# Altium project Capacitive Soil Moisture Sensor.PrjPcb
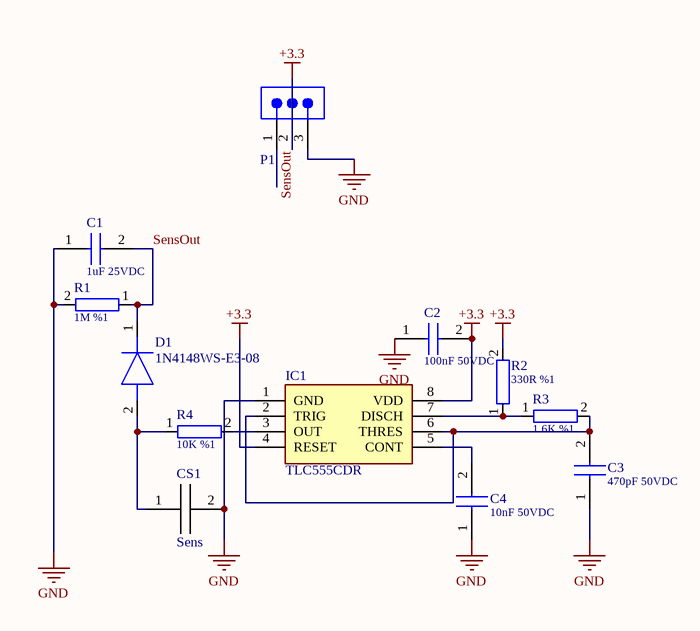
[diagram p0: CSMS.SchDoc]
3 sheets, 23 parts. Net scope: global (net labels, ports and power ports of the same name join across sheets).
Board file: CSMSCMP.PcbDoc
Sheets:
  CSMS.SchDoc
  CSMSF.SchDoc
  CMP.SchDoc

## Sheet CSMS.SchDoc
size A4; SheetNumber: 1; SheetTotal: 3

### Parts
C1  value 1uF 25VDC  [0603 CAP]  (hidden comment: CL10B105KA8NNNC)
C2  value 100nF 50VDC  [0603 CAP]  (hidden comment: CL10B104KB8NNNC)
C3  value 470pF 50VDC  [0603 CAP]  (hidden comment: CL10B471KB8NNNC)
C4  value 10nF 50VDC  [0603 CAP]  (hidden comment: CC0603KRX7R9BB103)
CS1  Sens  [Sens]
D1  1N4148WS-E3-08  [SOD2513X110N]
IC1  TLC555CDR  [SOIC127P600X175-8N]
P1  61300311021  [61300311021]  (value not drawn)
R1  value 1M %1  [0603 RES]  (hidden comment: 0603SAF1004T5E)
R2  value 330R %1  [0603 RES]  (hidden comment: 0603SAF3300T5E)
R3  value 1.6K %1  [0603 RES]  (hidden comment: 0603SAF1601T5E)
R4  value 10K %1  [0603 RES]  (hidden comment: 0603SAF1002T5E)

### Nets
+3.3: C2.2 IC1.4(RESET) IC1.8(VDD) P1.2 R2.2
GND: C1.1 C2.1 C3.1 C4.1 CS1.2 IC1.1(GND) P1.3 R1.2
SensOut: C1.2 D1.1(K) P1.1 R1.1
NetC3_2: C3.2 IC1.2(TRIG) IC1.6(THRES) R3.2
NetC4_2: C4.2 IC1.5(CONT)
NetCS1_1: CS1.1 D1.2(A) R4.1
NetIC1_3: IC1.3(OUT) R4.2
NetIC1_7: IC1.7(DISCH) R2.1 R3.1

### Library data of the parts
C1 = CL10B105KA8NNNC: 1uF 25VDC ±10% X7R MLCC 0603; Ozdisan Price/Stock: https://ozdisan.com/Product/Detail/522144/CL10A106MO8NQNC; Supplier 1: Ozdisan; Supplier Part Number 1: CL10B105KA8NNNC; Supplier 2: Digi-Key; Supplier Part Number 2: 1276-1184-1-ND
C2 = CL10B104KB8NNNC: 100nF 50VDC ±10% X7R MLCC 0603; Ozdisan Price/Stock: https://ozdisan.com/Product/Detail/522144/CL10A106MO8NQNC; Supplier 1: Arrow Electronics; Supplier Part Number 1: CL10B104KB8NNNC
C3 = CL10B471KB8NNNC: 470pF 50VDC ±10% X7R MLCC 0603; Ozdisan Price/Stock: https://ozdisan.com/Product/Detail/522144/CL10A106MO8NQNC; Supplier 1: Mouser; Supplier Part Number 1: 187-CL10B471KB8NNNC
C4 = CC0603KRX7R9BB103: 10nF, 50 V, ± 10%, X7R, 0603, Multilayer Ceramic Capacitor,; Ozdisan Price/Stock: https://ozdisan.com/Product/Detail/522144/CL10A106MO8NQNC; Supplier 1: Digi-Key; Supplier Part Number 1: 311-1085-1-ND
CS1 = Sens: Pcb Sens
D1 = 1N4148WS-E3-08: Diode; Manufacturer_Name: Vishay; Datasheet Link: https://datasheet.datasheetarchive.com/originals/distributors/Datasheets-DGA23/1390442.pdf; Height: 1.15mm; Manufacturer_Part_Number: 1N4148WS-E3-08; Mouser Part Number: 78-1N4148WS-E3-08; Mouser Price/Stock: https://www.mouser.co.uk/ProductDetail/Vishay-Semiconductors/1N4148WS-E3-08?qs=bTzheeSci6R8fv1OBRENhQ%3D%3D; Arrow Part Number: 1N4148WS-E3-08; Arrow Price/Stock: https://www.arrow.com/en/products/1n4148ws-e3-08/vishay?region=europe; Supplier 1: Mouser; Supplier Part Number 1: 78-1N4148WS-E3-08
IC1 = TLC555CDR: 555 Astable 2.1-MHz, 250-µA, Low-Power Timer 8-SOIC 0 to 70; Manufacturer_Name: Texas Instruments; Datasheet Link: https://www.ti.com/lit/ds/symlink/tlc555.pdf?ts=1599218356509&ref_url=https%253A%252F%252Fwww.ti.com%252Fstore%252Fti%252Fen%252Fp%252Fproduct%252F%253Fp%253DTLC555CDR%2526keyMatch%253DTLC555CDR%2526tisearch%253DSearch-EN-everything%2526usecase%253DOPN; Height: 1.75mm; Manufacturer_Part_Number: TLC555CDR; Mouser Part Number: 595-TLC555CDR; Mouser Price/Stock: https://www.mouser.co.uk/ProductDetail/Texas-Instruments/TLC555CDR?qs=gb35HGp1gQImgWgRW%252BGYaw%3D%3D; Arrow Part Number: TLC555CDR; Arrow Price/Stock: https://www.arrow.com/en/products/tlc555cdr/texas-instruments?region=nac; Supplier 1: Mouser; Supplier Part Number 1: 595-TLC555CDR
P1 = 61300311021: WR-PHD Pin Header, THT, Angled, pitch 2.54mm, 1 Row, 3P; Manufacturer: Wurth Elektronik; Contact Resistance: 20mΩ; Rated Current: 3A; Working Voltage: 250V; Withstanding Voltage: 500V; ComponentLink1Description: Website Link; ComponentLink1URL: https://www.we-online.com/redexpert/article/61300311021?ad; ComponentLink2Description: Datasheet Link; ComponentLink2URL: https://www.we-online.com/redexpert/spec/61300311021?ad; Manufacturer Part Number: 61300311021; Category: Board-to-Board Connectors; Match Code: WR-PHD; Mount: Through Hole; Operating Temperature Max: 105°C; Operating Temperature Min: -40°C; Packaging: Bag; Gender: Pin Header; Number of Pins: 3; Number of Rows: 1; Orientation: Angled; Pitch: 2.54mm; Supplier 1: Digi-Key; Supplier Part Number 1: 732-5336-ND
R1 = 0603SAF1004T5E: 1M Ohms 1% 1/10W-S 100PPM RES 0603; Ozdisan Price/Stock: https://ozdisan.com/Product/Detail/522144/CL10A106MO8NQNC; Supplier 1: Newark; Supplier Part Number 1: 79M5904
R2 = 0603SAF3300T5E: 330R Ohms 1% 1/10W-S 100PPM RES 0603; Ozdisan Price/Stock: https://ozdisan.com/Product/Detail/522144/CL10A106MO8NQNC; Supplier 1: Mouser; Supplier Part Number 1: 603-RC0603FR-07330RL
R3 = 0603SAF1601T5E: 1.6K Ohms 1% 1/10W-S 100PPM RES 0603; Ozdisan Price/Stock: https://ozdisan.com/Product/Detail/522144/CL10A106MO8NQNC; Supplier 1: Avnet; Supplier Part Number 1: 39P9958
R4 = 0603SAF1002T5E: 10K Ohms 1% 1/10W-S 100PPM RES 0603; Ozdisan Price/Stock: https://ozdisan.com/Product/Detail/522144/CL10A106MO8NQNC; Supplier 1: Farnell; Supplier Part Number 1: 1632392

## Sheet CSMSF.SchDoc
size A4; SheetNumber: 2; SheetTotal: 3
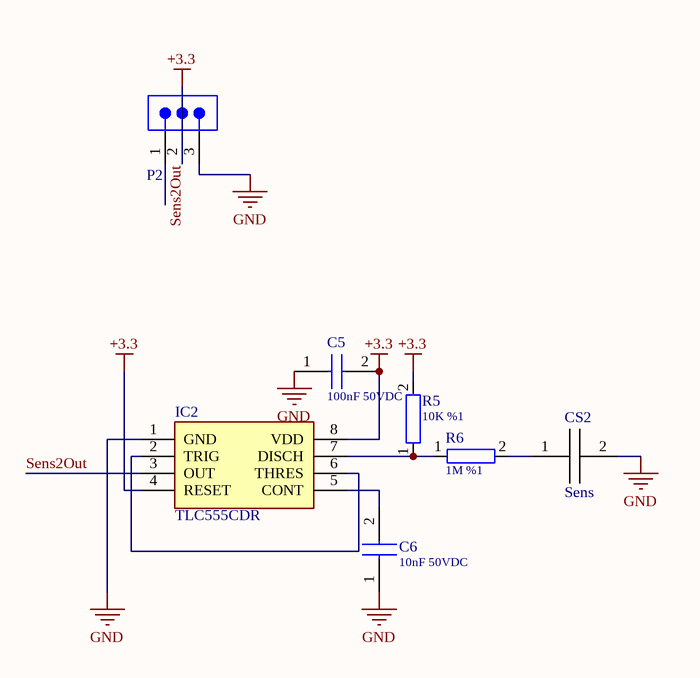
[diagram p1: CSMSF.SchDoc]

### Parts
C5  value 100nF 50VDC  [0603 CAP]  (hidden comment: CL10B104KB8NNNC)
C6  value 10nF 50VDC  [0603 CAP]  (hidden comment: CC0603KRX7R9BB103)
CS2  Sens  [Sens]
IC2  TLC555CDR  [SOIC127P600X175-8N]
P2  61300311021  [61300311021]  (value not drawn)
R5  value 10K %1  [0603 RES]  (hidden comment: 0603SAF1002T5E)
R6  value 1M %1  [0603 RES]  (hidden comment: 0603SAF1004T5E)

### Nets
+3.3: C5.2 IC2.4(RESET) IC2.8(VDD) P2.2 R5.2
GND: C5.1 C6.1 CS2.2 IC2.1(GND) P2.3
Sens2Out: IC2.3(OUT) P2.1
NetC6_2: C6.2 IC2.5(CONT)
NetCS2_1: CS2.1 R6.2
NetIC2_2: IC2.2(TRIG) IC2.6(THRES)
NetIC2_7: IC2.7(DISCH) R5.1 R6.1

### Library data of the parts
C5 = CL10B104KB8NNNC: 100nF 50VDC ±10% X7R MLCC 0603; Ozdisan Price/Stock: https://ozdisan.com/Product/Detail/522144/CL10A106MO8NQNC; Supplier 1: Arrow Electronics; Supplier Part Number 1: CL10B104KB8NNNC
C6 = CC0603KRX7R9BB103: as C4 on sheet CSMS; Ozdisan Price/Stock: https://ozdisan.com/Product/Detail/522144/CL10A106MO8NQNC; Supplier 1: Digi-Key; Supplier Part Number 1: 311-1085-1-ND
CS2 = Sens: Pcb Sens
IC2 = TLC555CDR: as IC1 on sheet CSMS; Datasheet Link: https://www.ti.com/lit/ds/symlink/tlc555.pdf?ts=1599218356509&ref_url=https%253A%252F%252Fwww.ti.com%252Fstore%252Fti%252Fen%252Fp%252Fproduct%252F%253Fp%253DTLC555CDR%2526keyMatch%253DTLC555CDR%2526tisearch%253DSearch-EN-everything%2526usecase%253DOPN; Height: 1.75mm; Manufacturer_Part_Number: TLC555CDR; Mouser Part Number: 595-TLC555CDR; Mouser Price/Stock: https://www.mouser.co.uk/ProductDetail/Texas-Instruments/TLC555CDR?qs=gb35HGp1gQImgWgRW%252BGYaw%3D%3D; Arrow Part Number: TLC555CDR; Arrow Price/Stock: https://www.arrow.com/en/products/tlc555cdr/texas-instruments?region=nac; Supplier 1: Mouser; Supplier Part Number 1: 595-TLC555CDR
P2 = 61300311021: as P1 on sheet CSMS; ComponentLink1Description: Website Link; ComponentLink1URL: https://www.we-online.com/redexpert/article/61300311021?ad; ComponentLink2Description: Datasheet Link; ComponentLink2URL: https://www.we-online.com/redexpert/spec/61300311021?ad; Manufacturer Part Number: 61300311021; Category: Board-to-Board Connectors; Match Code: WR-PHD; Mount: Through Hole; Operating Temperature Max: 105°C; Operating Temperature Min: -40°C; Packaging: Bag; Gender: Pin Header; Number of Pins: 3; Number of Rows: 1; Orientation: Angled; Pitch: 2.54mm; Supplier 1: Digi-Key; Supplier Part Number 1: 732-5336-ND
R5 = 0603SAF1002T5E: 10K Ohms 1% 1/10W-S 100PPM RES 0603; Ozdisan Price/Stock: https://ozdisan.com/Product/Detail/522144/CL10A106MO8NQNC; Supplier 1: Farnell; Supplier Part Number 1: 1632392
R6 = 0603SAF1004T5E: 1M Ohms 1% 1/10W-S 100PPM RES 0603; Ozdisan Price/Stock: https://ozdisan.com/Product/Detail/522144/CL10A106MO8NQNC; Supplier 1: Newark; Supplier Part Number 1: 79M5904

## Sheet CMP.SchDoc
size A4; SheetNumber: 3; SheetTotal: 3
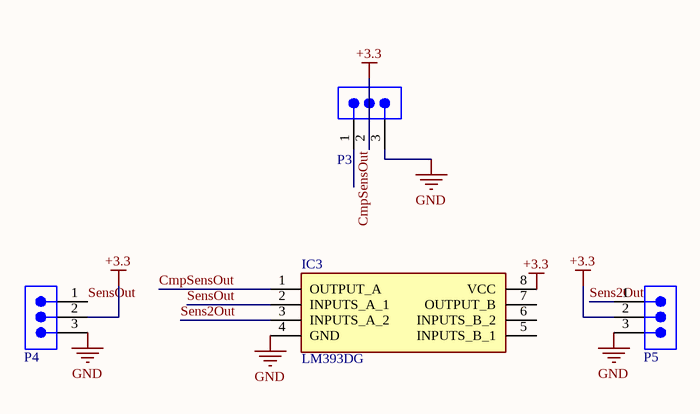
[diagram p2: CMP.SchDoc]

### Parts
IC3  LM393DG  [SOIC127P600X175-8N]
P3  61300311021  [61300311021]  (value not drawn)
P4  61300311021  [61300311021]  (value not drawn)
P5  61300311021  [61300311021]  (value not drawn)

### Nets
+3.3: IC3.8(VCC) P3.2 P4.2 P5.2
GND: IC3.4(GND) P3.3 P4.3 P5.3
CmpSensOut: IC3.1(OUTPUT_A) P3.1
Sens2Out: IC3.3(INPUTS_A_2) P5.1
SensOut: IC3.2(INPUTS_A_1) P4.1

Not connected (* = marked no-connect by the designer): IC3 5(INPUTS_B_1) 6(INPUTS_B_2) 7(OUTPUT_B)

### Library data of the parts
IC3 = LM393DG: Integrated Circuit; Manufacturer_Name: onsemi; Datasheet Link: https://www.onsemi.com/pub/Collateral/LM393-D.PDF; Height: 1.75mm; Manufacturer_Part_Number: LM393DG; Mouser Part Number: 863-LM393DG; Mouser Price/Stock: https://www.mouser.co.uk/ProductDetail/onsemi/LM393DG?qs=2OtswVQKCOHzXsheSqC0ow%3D%3D; Arrow Part Number: LM393DG; Arrow Price/Stock: https://www.arrow.com/en/products/lm393dg/on-semiconductor?region=nac
P3-P5 = 61300311021: as P1 on sheet CSMS; ComponentLink1Description: Website Link; ComponentLink1URL: https://www.we-online.com/redexpert/article/61300311021?ad; ComponentLink2Description: Datasheet Link; ComponentLink2URL: https://www.we-online.com/redexpert/spec/61300311021?ad; Manufacturer Part Number: 61300311021; Category: Board-to-Board Connectors; Match Code: WR-PHD; Mount: Through Hole; Operating Temperature Max: 105°C; Operating Temperature Min: -40°C; Packaging: Bag; Gender: Pin Header; Number of Pins: 3; Number of Rows: 1; Orientation: Angled; Pitch: 2.54mm; Supplier 1: Digi-Key; Supplier Part Number 1: 732-5336-ND

## Nets that join several sheets
+3.3: CSMS (5 pins), CSMSF (5 pins), CMP (IC3.8 P3.2 P4.2 P5.2)
GND: CSMS (8 pins), CSMSF (5 pins), CMP (IC3.4 P3.3 P4.3 P5.3)
Sens2Out: CSMSF (IC2.3 P2.1), CMP (IC3.3 P5.1)
SensOut: CSMS (C1.2 D1.1 P1.1 R1.1), CMP (IC3.2 P4.1)